# EAGLE design berlingo synth 0.5 (EAGLE 6.6.0)
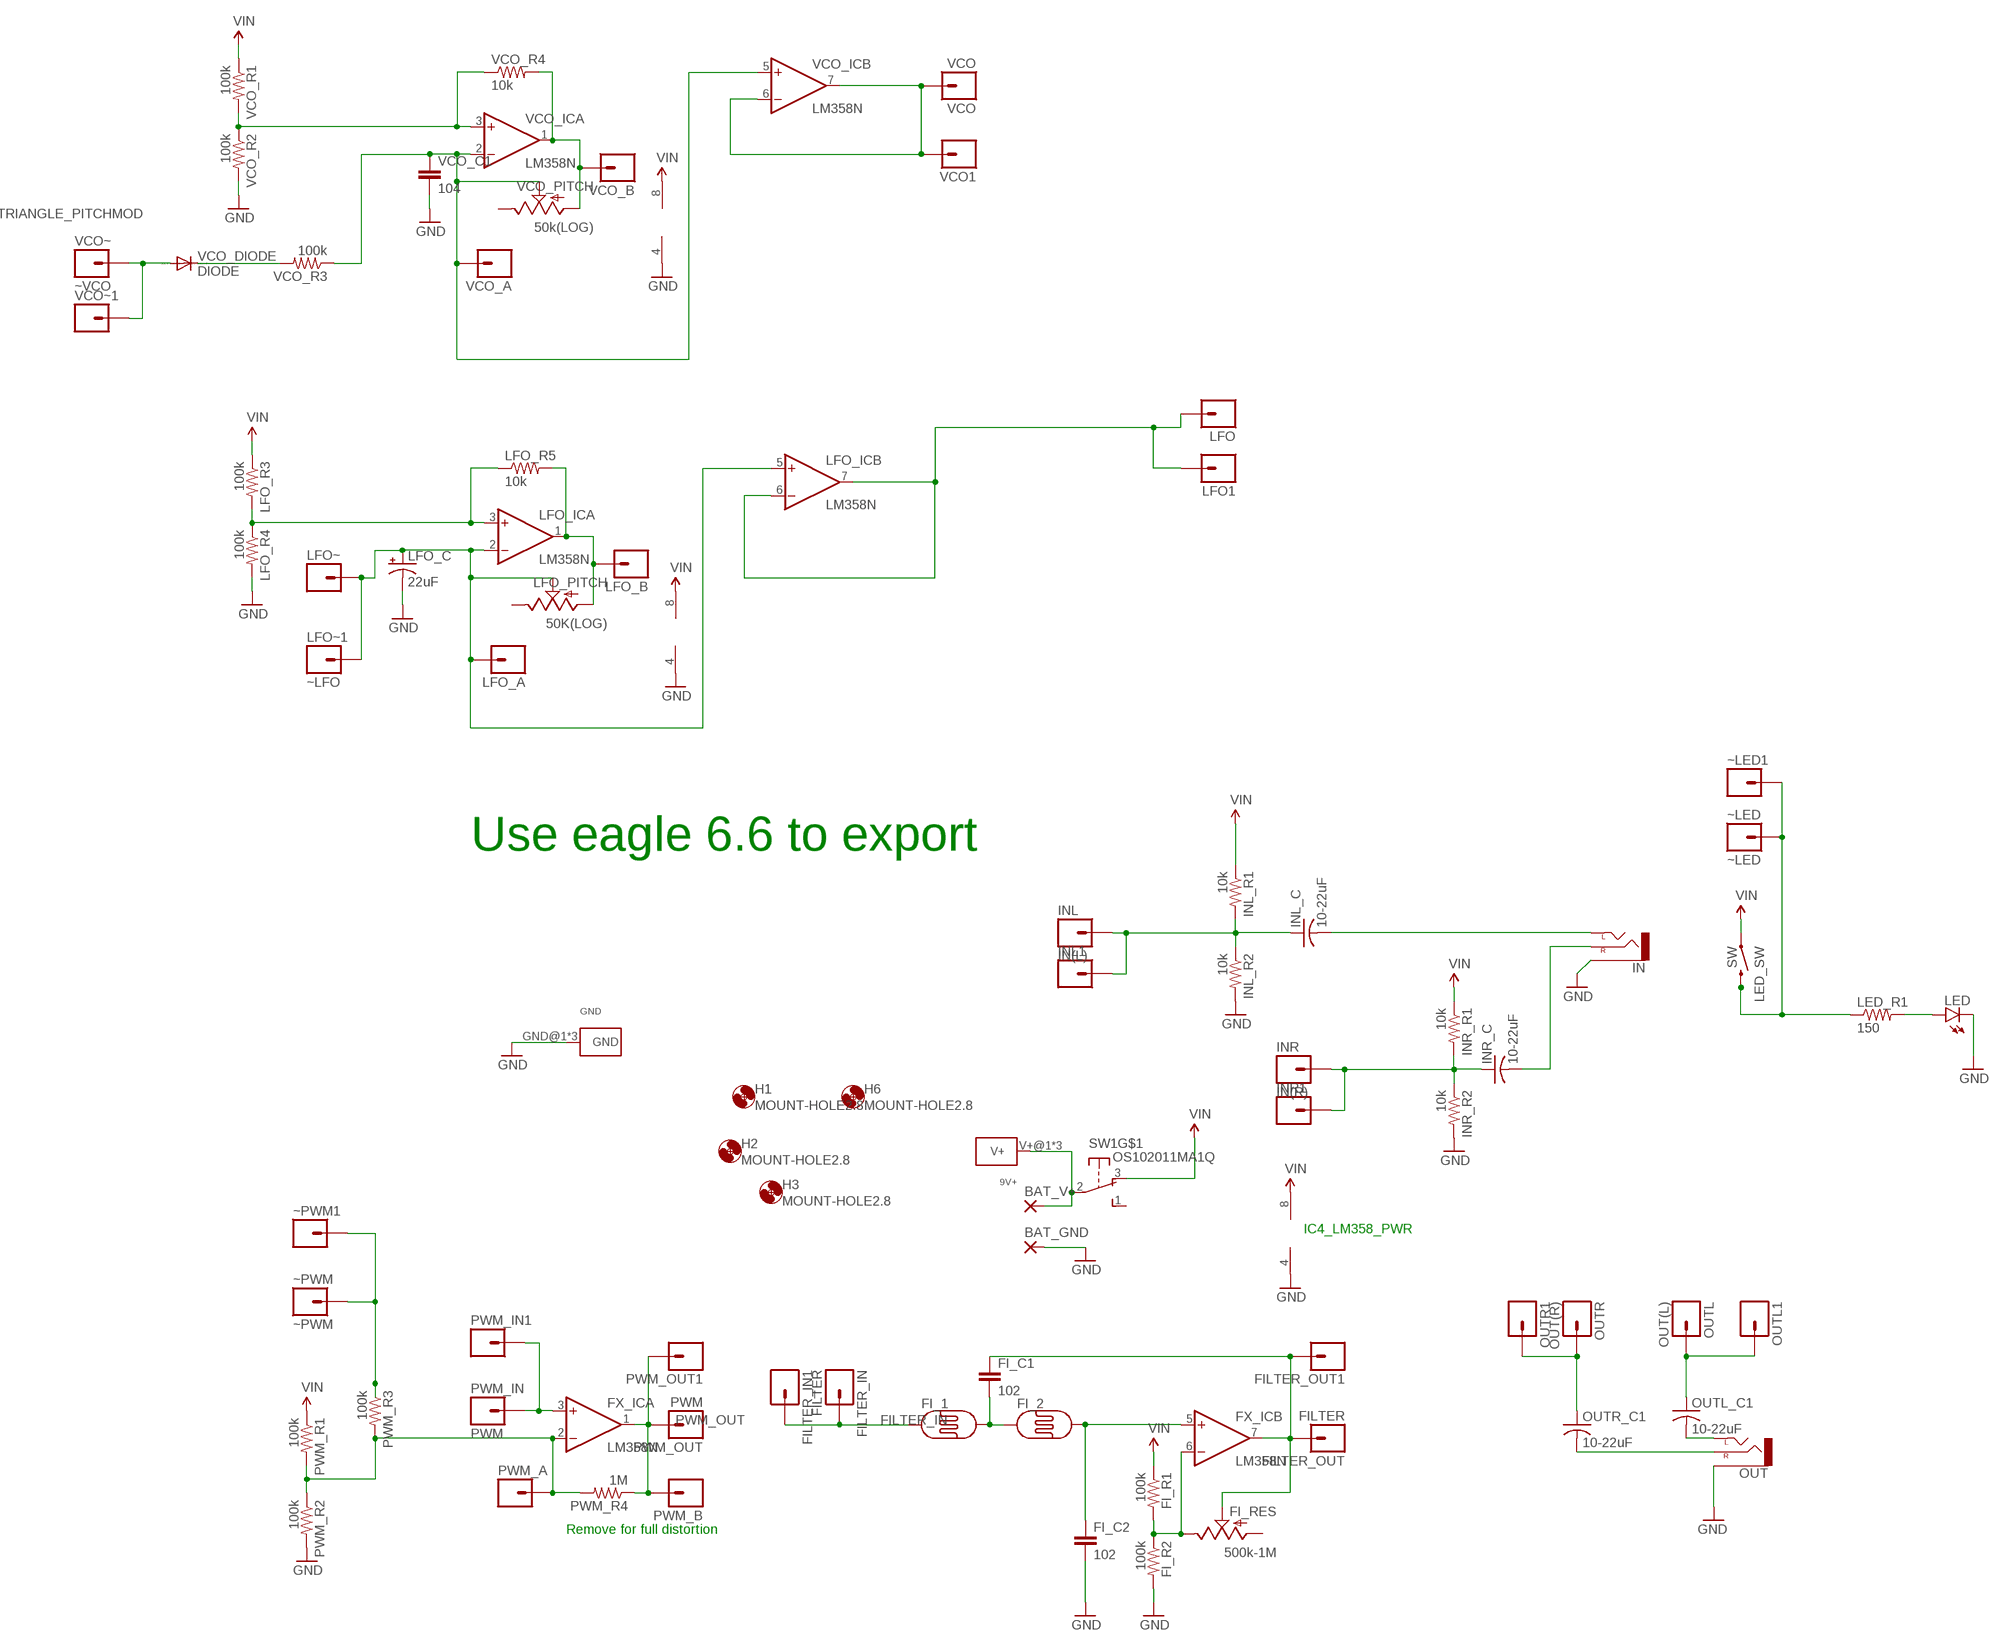
[diagram p0: schematic, sheet 1]

## Parts
9V+  KEYSTONE-629+  [KEYSTONE_BATTAERY_TERMINAL-629+]
BAT_GND  3,81/1,4  [3,81/1,4]
BAT_V+  3,81/1,4  [3,81/1,4]
FI_1  PHOTOCELLPTH  [PHOTOCELL]
FI_2  PHOTOCELLPTH  [PHOTOCELL]
FI_C1  102  CAPEZ  [CAP-PTH-SMALLEZ]
FI_C2  102  CAPEZ  [CAP-PTH-SMALLEZ]
FI_R1  100k  R-US_0207/10  [0207/10]
FI_R2  100k  R-US_0207/10  [0207/10]
FI_RES  500k-1M  POT  [ALPS_POT]
FILTER_IN  FILTER  HEADER-1X1  [1X01_SIDE_NAME]
FILTER_IN1  HEADER-1X1  [1X01_SIDE_NAME]
FILTER_OUT  FILTER  HEADER-1X1  [1X01_SIDE_NAME]
FILTER_OUT1  HEADER-1X1  [1X01_SIDE_NAME]
FX_IC  LM358N  [DIL08]
GND  KEYSTONE-629  [KEYSTONE_AA_AAA_BATTERY_TERMINAL-629]
H1  MOUNT-HOLE2.8  [2,8]
H2  MOUNT-HOLE2.8  [2,8]
H3  MOUNT-HOLE2.8  [2,8]
H6  MOUNT-HOLE2.8  [2,8]
IN  AUDIO-JACKPTH  [AUDIO-JACK]
INL  IN(L)  HEADER-1X1  [1X01_SIDE_NAME]
INL1  HEADER-1X1  [1X01_SIDE_NAME]
INL_C  10-22uF  C-US025-024X044  [C025-024X044]
INL_R1  10k  R-US_0207/10  [0207/10]
INL_R2  10k  R-US_0207/10  [0207/10]
INR  IN(R)  HEADER-1X1  [1X01_SIDE_NAME]
INR1  HEADER-1X1  [1X01_SIDE_NAME]
INR_C  10-22uF  C-US025-024X044  [C025-024X044]
INR_R1  10k  R-US_0207/10  [0207/10]
INR_R2  10k  R-US_0207/10  [0207/10]
LED  LED5MM  [LED5MM]
LED_R1  150  R-US_0207/10  [0207/10]
LED_SW  SW  SWITCH-MOMENTARY-212MM  [TACTILE-PTH-12MM]
LFO  HEADER-1X1  [1X01_SIDE_NAME]
LFO1  HEADER-1X1  [1X01_SIDE_NAME]
LFO_A  HEADER-1X1  [1X01_SIDE_NAME]
LFO_B  HEADER-1X1  [1X01_SIDE_NAME]
LFO_C  22uF  CPOL-USE2.5-6  [E2,5-6]
LFO_IC  LM358N  [DIL08]
LFO_PITCH  50K(LOG)  POT  [ALPS_POT]
LFO_R3  100k  R-US_0207/10  [0207/10]
LFO_R4  100k  R-US_0207/10  [0207/10]
LFO_R5  10k  R-US_0207/10  [0207/10]
LFO~  HEADER-1X1  [1X01_SIDE_NAME]
LFO~1  ~LFO  HEADER-1X1  [1X01_SIDE_NAME]
OUT  AUDIO-JACKPTH  [AUDIO-JACK]
OUTL  OUT(L)  HEADER-1X1  [1X01_SIDE_NAME]
OUTL1  HEADER-1X1  [1X01_SIDE_NAME]
OUTL_C1  10-22uF  C-US025-024X044  [C025-024X044]
OUTR  OUT(R)  HEADER-1X1  [1X01_SIDE_NAME]
OUTR1  HEADER-1X1  [1X01_SIDE_NAME]
OUTR_C1  10-22uF  C-US025-024X044  [C025-024X044]
PWM_A  HEADER-1X1  [1X01_SIDE_NAME]
PWM_B  HEADER-1X1  [1X01_SIDE_NAME]
PWM_IN  PWM  HEADER-1X1  [1X01_SIDE_NAME]
PWM_IN1  HEADER-1X1  [1X01_SIDE_NAME]
PWM_OUT  PWM  HEADER-1X1  [1X01_SIDE_NAME]
PWM_OUT1  HEADER-1X1  [1X01_SIDE_NAME]
PWM_R1  100k  R-US_0207/10  [0207/10]
PWM_R2  100k  R-US_0207/10  [0207/10]
PWM_R3  100k  R-US_0207/10  [0207/10]
PWM_R4  1M  R-US_0207/10  [0207/10]
SW1  OS102011MA1Q  [OS102011MA1Q]
VCO  VCO  HEADER-1X1  [1X01_SIDE_NAME]
VCO1  HEADER-1X1  [1X01_SIDE_NAME]
VCO_A  HEADER-1X1  [1X01_SIDE_NAME]
VCO_B  HEADER-1X1  [1X01_SIDE_NAME]
VCO_C1  104  CAPEZ  [CAP-PTH-SMALLEZ]
VCO_DIODE  DIODE  1N4004  [DO41-10]
VCO_IC  LM358N  [DIL08]
VCO_PITCH  50k(LOG)  POT  [ALPS_POT]
VCO_R1  100k  R-US_0207/10  [0207/10]
VCO_R2  100k  R-US_0207/10  [0207/10]
VCO_R3  100k  R-US_0207/10  [0207/10]
VCO_R4  10k  R-US_0207/10  [0207/10]
VCO~  ~VCO  HEADER-1X1  [1X01_SIDE_NAME]
VCO~1  HEADER-1X1  [1X01_SIDE_NAME]
~LED  ~LED  HEADER-1X1  [1X01_SIDE_NAME]
~LED1  HEADER-1X1  [1X01_SIDE_NAME]
~PWM  ~PWM  HEADER-1X1  [1X01_SIDE_NAME]
~PWM1  HEADER-1X1  [1X01_SIDE_NAME]

## Nets
FILTER_IN: FI_1.1 FILTER_IN1.1 FILTER_IN.1
FILTER_OUT: FI_C1.1 FI_RES.P$2(S) FILTER_OUT1.1 FILTER_OUT.1 FX_IC.7(B:OUT)
GND: BAT_GND.1(P) FI_C2.2 FI_R2.2 FX_IC.4(P:V-) GND.GND@1(GND) GND.GND@2(GND) GND.GND@3(GND) IN.SLEEVE INL_R2.2 INR_R2.2 LED.K(C) LFO_C.- LFO_IC.4(P:V-) LFO_R4.2 OUT.SLEEVE PWM_R2.2 VCO_C1.2 VCO_IC.4(P:V-) VCO_R2.2
LFO: LFO1.1 LFO.1 LFO_IC.6(B:-IN) LFO_IC.7(B:OUT)
MOD_IN: FX_IC.3(A:+IN) PWM_IN1.1 PWM_IN.1
N$1: 9V+.V+@1(V+) 9V+.V+@2(V+) 9V+.V+@3(V+) BAT_V+.1(P) SW1.2(P)
N$2: VCO_DIODE.C VCO_R3.2
N$3: FX_IC.2(A:-IN) PWM_A.1 PWM_R1.2 PWM_R2.1 PWM_R3.2 PWM_R4.2
N$4: VCO_IC.3(A:+IN) VCO_R1.2 VCO_R2.1 VCO_R4.1
N$5: PWM_R3.1 ~PWM1.1 ~PWM.1
N$6: LED.A LED_R1.2
N$7: FI_2.2 FI_C2.1 FX_IC.5(B:+IN)
N$8: FI_1.2 FI_2.1 FI_C1.2
N$9: OUTR1.1 OUTR.1 OUTR_C1.1
N$10: VCO_B.1 VCO_IC.1(A:OUT) VCO_PITCH.P$3(A) VCO_R4.2
N$11: OUT.TIP(LEFT) OUTL_C1.2
N$12: OUTL1.1 OUTL.1 OUTL_C1.1
N$13: LED_R1.1 LED_SW.3 ~LED1.1 ~LED.1
N$14: INR1.1 INR.1 INR_C.1 INR_R1.2 INR_R2.1
N$15: IN.RING(RIGHT) INR_C.2
N$16: FI_R1.2 FI_R2.1 FI_RES.P$1(E) FX_IC.6(B:-IN)
N$17: LFO_IC.3(A:+IN) LFO_R3.2 LFO_R4.1 LFO_R5.1
N$18: VCO_A.1 VCO_C1.1 VCO_IC.2(A:-IN) VCO_IC.5(B:+IN) VCO_PITCH.P$2(S) VCO_R3.1
N$19: INL1.1 INL.1 INL_C.1 INL_R1.2 INL_R2.1
N$20: IN.TIP(LEFT) INL_C.2
N$21: LFO_B.1 LFO_IC.1(A:OUT) LFO_PITCH.P$3(A) LFO_R5.2
N$22: LFO_A.1 LFO_C.+ LFO_IC.2(A:-IN) LFO_IC.5(B:+IN) LFO_PITCH.P$2(S) LFO~1.1 LFO~.1
N$23: VCO1.1 VCO.1 VCO_IC.6(B:-IN) VCO_IC.7(B:OUT)
N$24: OUT.RING(RIGHT) OUTR_C1.2
PWM_OUT: FX_IC.1(A:OUT) PWM_B.1 PWM_OUT1.1 PWM_OUT.1 PWM_R4.1
TRIANGLE_PITCHMOD: VCO_DIODE.A VCO~1.1 VCO~.1
VIN: FI_R1.1 FX_IC.8(P:V+) INL_R1.1 INR_R1.1 LED_SW.1 LFO_IC.8(P:V+) LFO_R3.1 PWM_R1.1 SW1.3(O) VCO_IC.8(P:V+) VCO_R1.1
Unconnected: FI_RES.P$3(A) LFO_PITCH.P$1(E) SW1.1(S) SW1.MT1(MT) SW1.MT2(MT) VCO_PITCH.P$1(E)

## Notes on the sheet
- Use eagle 6.6 to export
- IC4_LM358_PWR
- Remove for full distortion

## Library data of the parts
9V+ = kanflo:KEYSTONE-629+
BAT_GND BAT_V+ = wirepad:3,81/1,4: THROUGH-HOLE PAD
FI_1 FI_2 = SparkFun-Sensors:PHOTOCELL: CdS photoresistor. This is a low cost way to detect light levels. Resistance decreases with more incoming light. SparkFun SKU: SEN-09088
FI_C1 FI_C2 VCO_C1 = SparkFun-Capacitors:CAP: Capacitor Standard 0603 ceramic capacitor, and 0.1" leaded capacitor.
FI_R1 FI_R2 INL_R1 INL_R2 INR_R1 INR_R2 LED_R1 LFO_R3-LFO_R5 PWM_R1-PWM_R4 VCO_R1-VCO_R4 = resistor:R-US_: RESISTOR, American symbol
FI_RES LFO_PITCH VCO_PITCH = SparkFun-Electromechanical:POT; PROD_ID: RES-09177
FILTER_IN FILTER_IN1 FILTER_OUT FILTER_OUT1 INL INL1 INR INR1 LFO LFO1 LFO_A LFO_B LFO~ LFO~1 OUTL OUTL1 OUTR OUTR1 PWM_A PWM_B PWM_IN PWM_IN1 PWM_OUT PWM_OUT1 VCO VCO1 VCO_A VCO_B VCO~ VCO~1 ~LED ~LED1 ~PWM ~PWM1 = TOF:HEADER-1X1: Header 1 Standard 1-pin 0.1" header. Use with straight break away headers (SKU : PRT-00116), right angle break away headers (PRT-00553), swiss pins (PRT-00743), machine pins (PRT-00117), and female headers (PRT-00115).
FX_IC LFO_IC VCO_IC = linear:LM358: OP AMP also LM158; LM258; LM2904 Source: http://cache.national.com/ds/LM/LM158.pdf
GND = kanflo:KEYSTONE-629: Keystone 629 PCB Mount Battery Contact for 1 (AA), 1 (AAA), 1 (N), Coil Spring Contact Links Data sheet <http://docs-europe.electrocomponents.com/webdocs/002e/0900766b8002ef6f.pdf> RS Online <http://se.rs-online.com/web/p/battery-holders-mounts/2050057/>
H1-H3 H6 = holes:MOUNT-HOLE: MOUNTING HOLE with drill center marker
IN OUT = SparkFun-Connectors:AUDIO-JACK: 3.5mm Audio Jack Simple 3.5mm common PCB mount audio jack. Variant PTH is our storefront SKU PRT-08032
INL_C INR_C OUTL_C1 OUTR_C1 = adafruit:C-US: CAPACITOR, American symbol
LED = SparkFun-LED:LED: LEDs Standard schematic elements and footprints for 5mm, 3mm, 1206, and 0603 sized LEDs. 5mm - Spark Fun Electronics SKU : COM-00529 (and others)
LED_SW = SparkFun-Electromechanical:SWITCH-MOMENTARY-2: Various NO switches- pushbuttons, reed, etc; PROD_ID: SWCH-09185
LFO_C = rcl:CPOL-US: POLARIZED CAPACITOR, American symbol
SW1 = adafruit:OS102011MA1Q: OS10201MA1Q through-hole right angle switch http://www.ladyada.net/library/eagle
VCO_DIODE = diode:1N4004: DIODE general purpose rectifier, 1 A

## Board
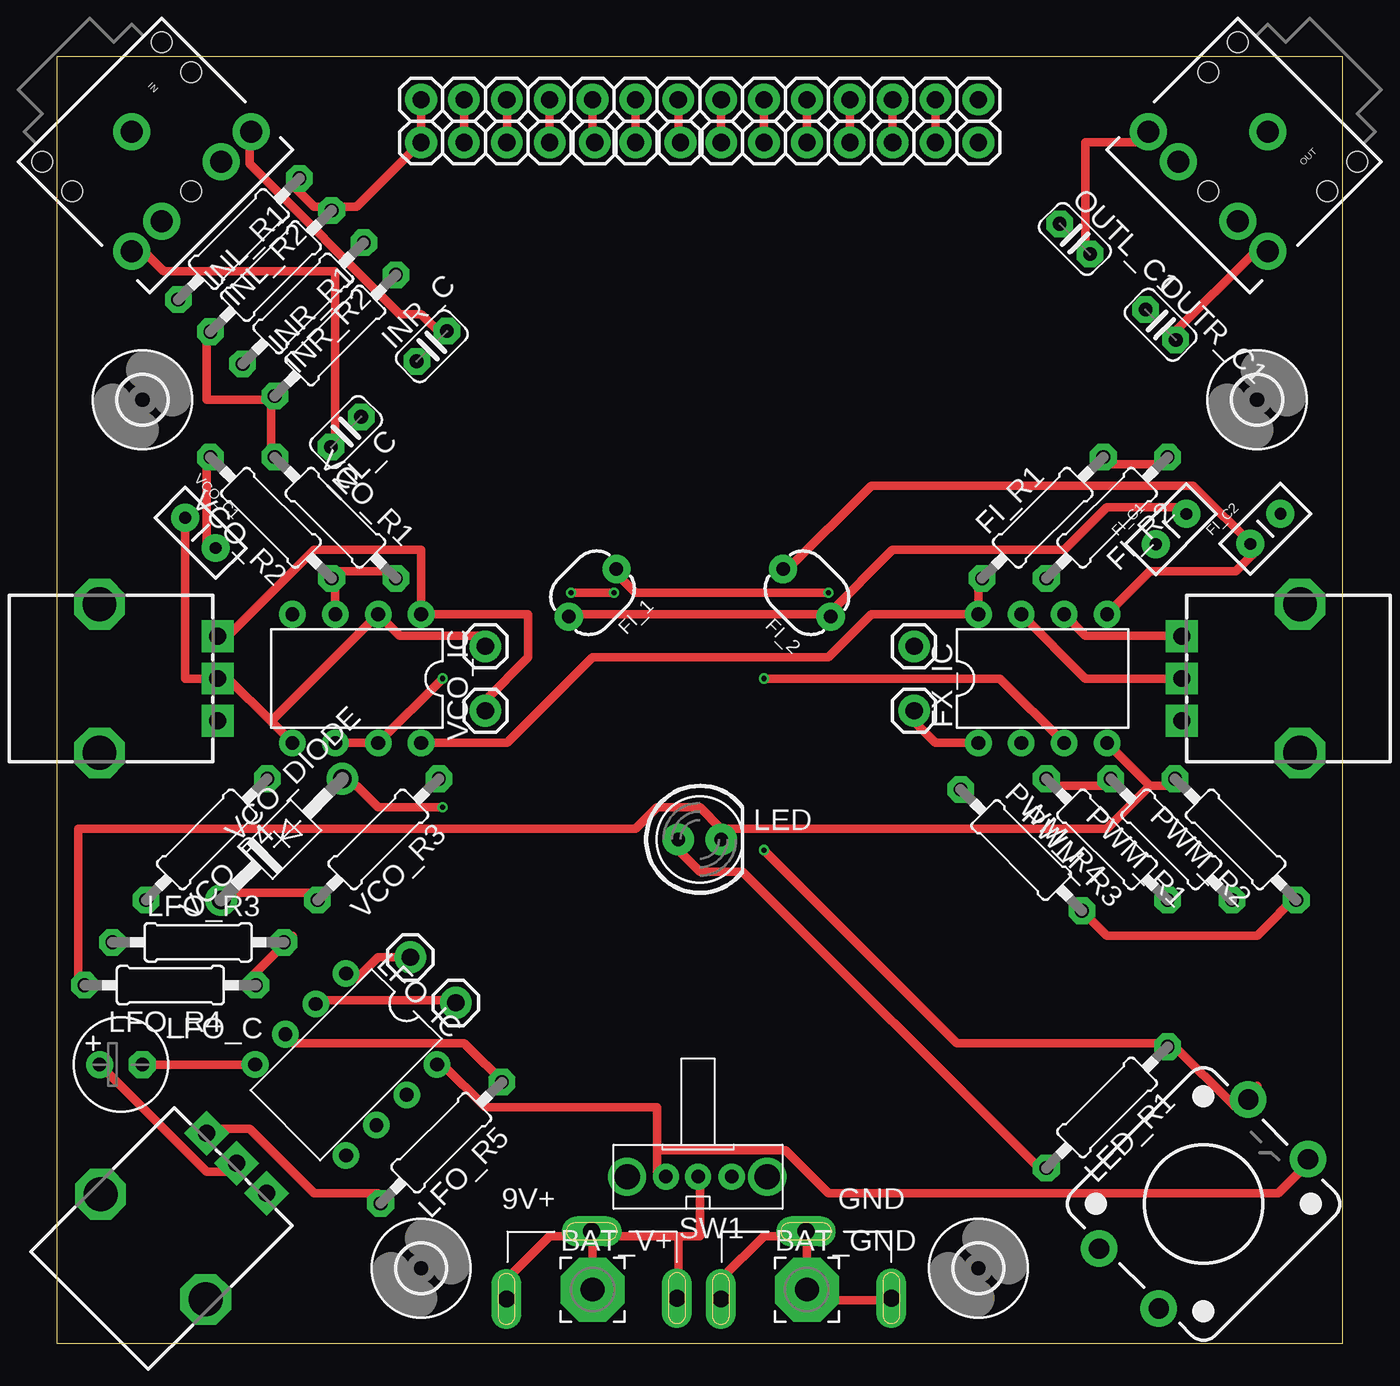
[diagram p1: board, top side]
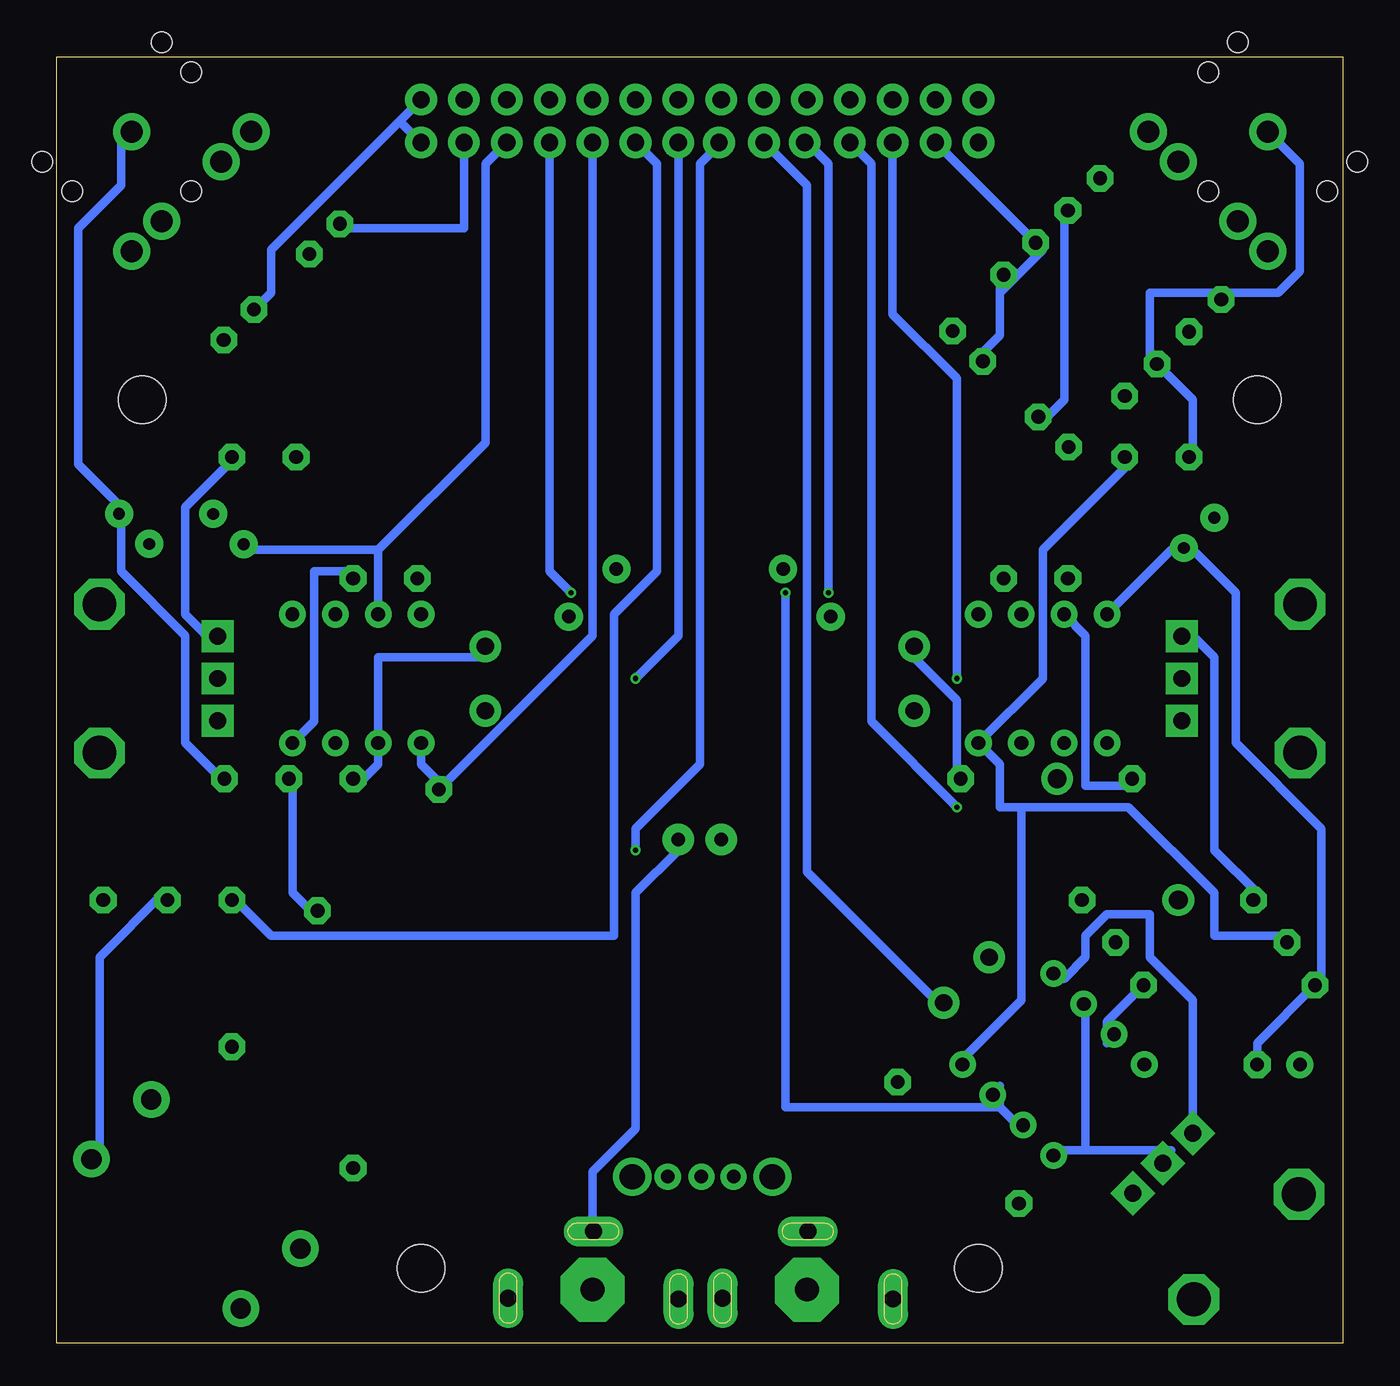
[diagram p2: board, bottom side, seen from below]

Size 76.2 x 76.2 mm. Coordinates in mm from the lower left corner, seen from the top.
Outline: 0,0 76.2,0 76.2,76.2 0,76.2 0,0
Copper layers (1*16): Top 0.035mm / dielectric 1.5mm / Bottom 0.035mm
Design rules "EagleRules *": minimum track width 20mil, minimum drill 12mil, track to track 7mil, track to pad 7mil, pad to pad 7mil, via to via 7mil, smd to smd 0mil, copper to edge 20mil, drill to drill 10mil, minimum pad ring 15mil, minimum via ring 6mil, stop-mask expansion 2mil, vias tented up to drill 25mil, thermal gap 10mil

### Footprints (pad centres in the part's own frame; a part is rotated, then mirrored left to right if it is on the bottom)
KEYSTONE_BATTAERY_TERMINAL-629+ = drill 1 pad 1.5 long: V+@1 5,-0.5; V+@2 -0.05,3.45; V+@3 -5.1,-0.55
3,81/1,4 = drill 1.397 pad 3.81 octagon: 1 0,0
PHOTOCELL = drill 0.8 pad 1.676: 1 -2,0; 2 2,0
CAP-PTH-SMALLEZ = drill 0.7 pad 1.651: 1 0,0; 2 2.54,0
0207/10 = drill 0.813 octagon: 1 -5.08,0; 2 5.08,0
ALPS_POT = drill 1 pad 1.88 square: P$1 7,-2.5; P$2 7,0; P$3 7,2.5 | drill 2 octagon: P$4 0,-4.4; P$5 0,4.4
1X01_SIDE_NAME = drill 1.016 pad 1.88: 1 0,0
DIL08 = drill 0.813 pad 1.27: 1 -3.81,-3.81; 2 -1.27,-3.81; 3 1.27,-3.81; 4 3.81,-3.81; 5 3.81,3.81; 6 1.27,3.81; 7 -1.27,3.81; 8 -3.81,3.81
KEYSTONE_AA_AAA_BATTERY_TERMINAL-629 = drill 1 pad 1.5 long: GND@1 5,-0.5; GND@2 -0.05,3.45; GND@3 -5.1,-0.55
2,8 = hole 2.8: 0,0
AUDIO-JACK = drill 1.3 pad 2.184: RING 5,5; RSH 5,2.5; SLEEVE 0,0; TIP 5,-5; TSH 5,-2.5 | hole 1.2: 0,5; -2.5,5; -2.5,-5; 0,-5; 5,0
C025-024X044 = drill 0.813 pad 1.422 octagon: 1 -1.27,0; 2 1.27,0
LED5MM = drill 0.813 pad 1.88: A -1.27,0; K 1.27,0
TACTILE-PTH-12MM = drill 1.2 pad 2.159: 1 6.25,-2.5; 2 -6.25,-2.5; 3 6.25,2.5; 4 -6.25,2.5
E2,5-6 = drill 0.813 pad 1.6: + -1.27,0 | drill 0.813 pad 1.6 octagon: - 1.27,0
OS102011MA1Q = drill 0.8 pad 1.422: 1 -2,0; 2 0,0; 3 1.9,0 | drill 1.5 pad 2.184: MT1 -4.1,0; MT2 4.2,0
DO41-10 = drill 1.118: A 5.08,0; C -5.08,0

### Placement (x,y rotation side)
9V+  31.75,3.17 0 top
BAT_GND  44.45,3.17 0 top
BAT_V+  31.75,3.17 0 top
FI_1  31.75,44.45 225 top
FI_2  44.45,44.45 135 top
FI_C1  65.12,47.32 45 top
FI_C2  70.71,47.34 45 top
FI_R1  58.42,48.9 45 top
FI_R2  62.23,48.9 225 top
FI_RES  73.66,39.37 180 top
FILTER_IN  46.99,71.12 270 top
FILTER_IN1  46.99,73.66 90 top
FILTER_OUT  49.53,71.12 270 top
FILTER_OUT1  49.53,73.66 90 top
FX_IC  58.42,39.37 0 top
GND  44.45,3.17 0 top
H1  71.12,55.88 0 top
H2  21.59,4.45 0 top
H3  54.61,4.45 0 top
H6  5.08,55.88 0 top
IN  4.45,71.75 315 top
INL  21.59,71.12 270 top
INL1  21.59,73.66 90 top
INL_C  17.14,53.98 225 top
INL_R1  12.7,63.5 45 top
INL_R2  10.79,65.41 225 top
INR  24.13,71.12 270 top
INR1  24.13,73.66 90 top
INR_C  22.23,59.05 45 top
INR_R1  16.51,59.69 45 top
INR_R2  14.61,61.59 225 top
LED  38.1,29.84 0 top
LED_R1  62.23,13.97 225 top
LED_SW  67.94,8.26 45 top
LFO  31.88,71.12 270 top
LFO1  31.75,73.66 0 top
LFO_A  23.65,20.17 135 top
LFO_B  20.95,22.86 135 top
LFO_C  3.81,16.51 0 top
LFO_IC  17.14,16.51 225 top
LFO_PITCH  5.71,5.71 45 top
LFO_R3  8.38,23.75 0 top
LFO_R4  6.73,21.21 180 top
LFO_R5  22.78,11.88 225 top
LFO~  34.29,73.66 90 top
LFO~1  34.29,71.12 270 top
OUT  71.75,71.75 225 top
OUTL  52.07,71.12 270 top
OUTL1  52.07,73.66 90 top
OUTL_C1  60.33,65.41 315 top
OUTR  54.61,71.12 270 top
OUTR1  54.61,73.66 90 top
OUTR_C1  65.41,60.33 315 top
PWM_A  50.8,41.27 0 top
PWM_B  50.8,37.47 0 top
PWM_IN  39.37,71.12 270 top
PWM_IN1  39.37,73.66 90 top
PWM_OUT  44.45,71.12 270 top
PWM_OUT1  44.45,73.66 90 top
PWM_R1  66.04,29.84 135 top
PWM_R2  69.85,29.84 135 top
PWM_R3  62.23,29.84 135 top
PWM_R4  57.15,29.21 315 top
SW1  38,9.87 180 top
VCO  26.67,71.12 270 top
VCO1  26.67,73.66 90 top
VCO_A  25.4,41.27 0 top
VCO_B  25.4,37.47 0 top
VCO_C1  7.62,48.9 315 top
VCO_DIODE  13.34,29.84 45 top
VCO_IC  17.78,39.37 180 top
VCO_PITCH  2.54,39.37 0 top
VCO_R1  16.51,48.9 315 top
VCO_R2  12.7,48.9 135 top
VCO_R3  19.05,29.84 225 top
VCO_R4  8.89,29.84 225 top
VCO~  29.21,71.12 270 top
VCO~1  29.21,73.66 90 top
~LED  36.96,71.12 270 top
~LED1  36.83,73.66 90 top
~PWM  41.91,71.12 270 top
~PWM1  41.91,73.66 90 top

### Tracks (layer width: path | path; a pad name or v marks a point on that pad's centre or on a via)
FILTER_IN  (via drill 0.3)
  Top 0.508: v45.72,44.45 34.29,44.45 33.02,45.72 FI_1.1 | FILTER_IN.1 FILTER_IN1.1
  Bottom 0.508: v45.72,44.45 46.99,45.72 FILTER_IN.1
FILTER_OUT
  Top 0.508: FILTER_OUT1.1 FILTER_OUT.1 | FX_IC.7 60.96,39.37 FI_RES.P$2
  Bottom 0.508: 57.15,46.99 64.77,46.99 FI_C1.1 | FX_IC.7 57.15,46.99 | FILTER_OUT.1 50.8,69.85 50.8,53.34 57.15,46.99
GND
  Top 0.508: LFO_C.- LFO_IC.4 | VCO_R2.2 8.89,52.07 8.89,46.99 VCO_C1.2 | 64.77,33.02 FX_IC.4 | 64.77,33.02 66.04,33.02 PWM_R2.2 | GND.GND@3 39.37,3.81 41.91,6.35 43.18,6.35 GND.GND@2 44.45,6.35 BAT_GND.1 44.45,2.54 49.53,2.54 GND.GND@1 | 64.77,33.02 62.23,30.48 39.37,30.48 | 39.37,30.48 38.1,31.75 35.56,31.75 34.29,30.48 1.27,30.48 1.27,21.59 LFO_R4.2 | 39.37,30.48 LED.K
  Bottom 0.508: LFO_C.- 5.08,17.78 LFO_R4.2 1.27,21.59 1.27,30.48 6.35,35.56 6.35,44.45 8.89,46.99 VCO_C1.2 10.16,46.99 VCO_IC.4 | VCO_R2.2 8.89,52.07 8.89,55.88 INR_R2.2 11.43,58.42 11.43,62.23 7.62,62.23 | IN.SLEEVE 2.54,69.85 2.54,63.5 3.81,62.23 7.62,62.23 | 7.62,62.23 INL_R2.2 | 72.39,49.53 74.93,52.07 74.93,66.04 72.39,68.58 72.39,71.12 OUT.SLEEVE | FX_IC.4 60.96,36.83 60.96,45.72 58.42,45.72 FI_R2.2 | LED.K 39.37,29.21 41.91,26.67 41.91,12.7 44.45,10.16 44.45,6.35 GND.GND@2 | 72.39,49.53 72.39,45.72 68.58,41.91 68.58,35.56 66.04,33.02 PWM_R2.2 | 72.39,49.53 FI_C2.2
LFO  (via drill 0.3)
  Top 0.508: LFO1.1 31.75,71.12 LFO.1 | v30.48,44.45 v33.02,44.45
  Bottom 0.508: 20.32,13.97 19.05,12.7 LFO_IC.6 | 20.32,13.97 20.32,15.24 LFO_IC.7 | 20.32,13.97 33.02,13.97 v33.02,44.45 | v30.48,44.45 30.48,69.85 31.75,71.12 LFO.1
MOD_IN  (via drill 0.3)
  Top 0.508: FX_IC.3 55.88,39.37 v41.91,39.37 | PWM_IN.1 PWM_IN1.1
  Bottom 0.508: v41.91,39.37 39.37,41.91 PWM_IN.1
N$1
  Top 0.508: 31.75,6.35 36.83,6.35 | 36.83,6.35 38.1,6.35 38.1,10.16 SW1.2 | 9V+.V+@3 26.67,3.81 29.21,6.35 30.48,6.35 9V+.V+@2 31.75,6.35 | 36.83,6.35 36.83,3.81 9V+.V+@1 | 31.75,6.35 BAT_V+.1
N$2
  Top 0.508: VCO_R3.2 15.24,26.67 10.16,26.67 VCO_DIODE.C
N$3
  Top 0.508: PWM_R2.1 73.66,26.67 71.12,24.13 62.23,24.13 60.96,25.4 PWM_R4.2 | PWM_R3.2 58.42,33.02 62.23,33.02 PWM_R1.2
  Bottom 0.508: PWM_R3.2 58.42,33.02 57.15,34.29 FX_IC.2 57.15,40.64 50.8,40.64 PWM_A.1 | PWM_R4.2 60.96,25.4 62.23,26.67 62.23,33.02 PWM_R1.2
N$4
  Top 0.508: VCO_IC.3 16.51,45.72 | 16.51,45.72 20.32,45.72 VCO_R1.2 | 16.51,45.72 VCO_R2.1
  Bottom 0.508: VCO_IC.3 15.24,41.91 15.24,33.02 12.7,33.02 VCO_R4.1
N$5
  Top 0.508: ~PWM.1 ~PWM1.1
  Bottom 0.508: ~PWM.1 40.64,69.85 40.64,45.72 43.18,43.18 43.18,24.13 63.5,24.13 66.04,26.67 PWM_R3.1
N$6
  Top 0.508: LED_R1.2 58.42,10.16 40.64,27.94 38.1,27.94 36.83,29.21 LED.A
N$7
  Top 0.508: FX_IC.5 64.77,45.72 69.85,45.72 71.12,46.99 | 71.12,46.99 67.31,50.8 48.26,50.8 43.18,45.72 FI_2.2 | 71.12,46.99 FI_C2.1
N$8
  Top 0.508: 45.72,43.18 49.53,46.99 59.69,46.99 62.23,49.53 67.31,49.53 FI_C1.2 | 45.72,43.18 30.48,43.18 FI_1.2 | 45.72,43.18 FI_2.1
N$9
  Bottom 0.508: OUTR1.1 55.88,72.39 | 55.88,72.39 63.5,64.77 63.5,62.23 OUTR_C1.1 64.77,60.96 | 55.88,72.39 OUTR.1
N$10
  Top 0.508: VCO_PITCH.P$3 10.16,41.91 15.24,46.99 21.59,46.99 VCO_IC.1 27.94,43.18 27.94,40.64 25.4,38.1 VCO_B.1
  Bottom 0.508: VCO_R4.2 5.08,26.67 7.62,29.21 7.62,40.64 8.89,41.91 VCO_PITCH.P$3
N$11
  Top 0.508: OUTL_C1.2 60.96,64.77 60.96,71.12 64.77,71.12 OUT.TIP
N$12
  Top 0.508: OUTL.1 OUTL1.1
  Bottom 0.508: OUTL.1 52.07,66.04 59.69,66.04 OUTL_C1.1
N$13  (via drill 0.3)
  Top 0.508: ~LED1.1 36.83,71.12 ~LED.1 | 66.04,17.78 69.85,13.97 LED_SW.3 71.12,15.24 | v41.91,29.21 53.34,17.78 66.04,17.78 | 66.04,17.78 LED_R1.1
  Bottom 0.508: v41.91,29.21 41.91,30.48 38.1,34.29 38.1,69.85 36.83,71.12 ~LED.1
N$14
  Top 0.508: INR1.1 INR.1
  Bottom 0.508: 20.32,62.23 20.32,63.5 INR_R1.2 | 20.32,62.23 20.32,59.69 21.59,58.42 INR_C.1 | 20.32,62.23 17.78,64.77 INR_R2.1 INR.1
N$15
  Top 0.508: INR_C.2 22.86,59.69 21.59,60.96 20.32,60.96 11.43,69.85 11.43,71.12 IN.RING
N$16
  Top 0.508: FI_R1.2 62.23,52.07 66.04,52.07 FI_R2.1 | FX_IC.6 60.96,41.91 66.04,41.91 FI_RES.P$1
  Bottom 0.508: FI_R2.1 66.04,52.07 68.58,49.53 68.58,43.18 67.31,41.91 FI_RES.P$1
N$17
  Top 0.508: LFO_R4.1 11.43,21.59 13.97,24.13 LFO_R3.2 | LFO_R5.1 26.67,15.24 24.13,17.78 13.97,17.78 LFO_IC.3
  Bottom 0.508: 11.43,21.59 LFO_R4.1 13.97,19.05 13.97,17.78 LFO_IC.3
N$18
  Top 0.508: VCO_A.1 25.4,41.91 20.32,41.91 VCO_IC.2 12.7,36.83 | 12.7,36.83 10.16,39.37 VCO_PITCH.P$2 7.62,39.37 VCO_C1.1 | 12.7,36.83 VCO_IC.5
  Bottom 0.508: VCO_R3.1 22.86,33.02 22.86,38.1 25.4,40.64 VCO_A.1
N$19
  Top 0.508: INL1.1 INL.1 17.78,67.31 16.51,67.31 | 16.51,67.31 15.24,67.31 13.97,68.58 INL_R2.1 | 16.51,67.31 INL_R1.2
  Bottom 0.508: INL_C.1 17.78,54.61 16.51,55.88 16.51,67.31 INL_R1.2
N$20
  Top 0.508: INL_C.2 16.51,53.34 16.51,63.5 6.35,63.5 5.08,64.77 IN.TIP
N$21
  Top 0.508: LFO_B.1 19.05,22.86 17.78,21.59 LFO_IC.1 | LFO_R5.2 19.05,8.89 15.24,8.89 11.43,12.7 8.89,12.7 LFO_PITCH.P$3
  Bottom 0.508: LFO_IC.1 16.51,21.59 15.24,22.86 15.24,24.13 13.97,25.4 11.43,25.4 11.43,22.86 8.89,20.32 8.89,12.7 LFO_PITCH.P$3
N$22
  Top 0.508: LFO_C.+ 8.89,10.16 10.16,10.16 LFO_PITCH.P$2 | LFO~.1 LFO~1.1 | LFO_IC.2 15.24,20.32 22.86,20.32 LFO_A.1
  Bottom 0.508: 15.24,11.43 10.16,11.43 LFO_PITCH.P$2 | 15.24,11.43 16.51,11.43 LFO_IC.5 | LFO~1.1 31.75,68.58 31.75,27.94 24.13,20.32 LFO_A.1 | 15.24,11.43 15.24,20.32 LFO_IC.2
N$23  (via drill 0.3)
  Top 0.508: VCO_IC.6 VCO_IC.7 v22.86,39.37 | VCO1.1 VCO.1
  Bottom 0.508: v22.86,39.37 22.86,57.15 26.67,60.96 VCO.1
N$24
  Top 0.508: OUTR_C1.2 66.04,59.69 71.12,64.77 OUT.RING
PWM_OUT
  Top 0.508: PWM_OUT1.1 PWM_OUT.1 | FX_IC.1 52.07,35.56 50.8,36.83 PWM_B.1
  Bottom 0.508: 53.34,33.02 54.61,34.29 FX_IC.1 | PWM_OUT.1 44.45,41.91 53.34,33.02 | 53.34,33.02 PWM_R4.1
TRIANGLE_PITCHMOD  (via drill 0.3)
  Top 0.508: v22.86,31.75 19.05,31.75 17.78,33.02 VCO_DIODE.A | VCO~.1 VCO~1.1
  Bottom 0.508: v22.86,31.75 27.94,36.83 27.94,69.85 VCO~.1
VIN
  Top 0.508: 35.56,11.43 35.56,13.97 25.4,13.97 22.86,16.51 LFO_IC.8 | 35.56,11.43 35.56,10.16 SW1.3 | 12.7,55.88 12.7,52.07 VCO_R1.1 | 12.7,55.88 8.89,55.88 8.89,59.69 INL_R1.1 | 12.7,55.88 INR_R1.1 | FI_R1.1 54.61,45.72 FX_IC.8 48.26,43.18 45.72,40.64 31.75,40.64 26.67,35.56 VCO_IC.8 | 35.56,11.43 43.18,11.43 45.72,8.89 72.39,8.89 73.66,10.16 LED_SW.1
  Bottom 0.508: PWM_R1.1 69.85,26.67 73.66,22.86 73.66,11.43 LED_SW.1 | 19.05,31.75 20.32,31.75 20.32,34.29 VCO_IC.8 17.78,39.37 17.78,46.99 12.7,52.07 VCO_R1.1 | 19.05,31.75 12.7,31.75 7.62,26.67 7.62,24.13 3.81,24.13 LFO_R3.1 | 19.05,31.75 19.05,20.32 22.86,16.51 LFO_IC.8

### Text on the board
tValues: IN | OUT | FILTER | RCO | 50K | 200K+ | VCO | PWM | BERLINGO / SYNTH 0.5 | LED | 50K | LFO
Reference: Use eagle 6.6 to export!
200bmp: C:/Users/thoma_000/Downloads/berlingo-caracter2.bmp | C:/Users/thoma_000/Downloads/berlingo-caracter2.bmp | C:/Users/thoma_000/Downloads/berlingo-caracter2.bmp